# Altium schematic sheet Vapeix_mini_nrf.SchDoc: Vapeix Mini PCB - nRF Radio
size A3; DrawnBy: Rock Jon; Organization: Altium Limited; Address1: L3, 12a Rodborough Rd; Address2: Frenchs Forest; Address3: NSW; Address4: Australia 2086; DocumentNumber: 1; Revision: v1.0; SheetNumber: 1; SheetTotal: 1
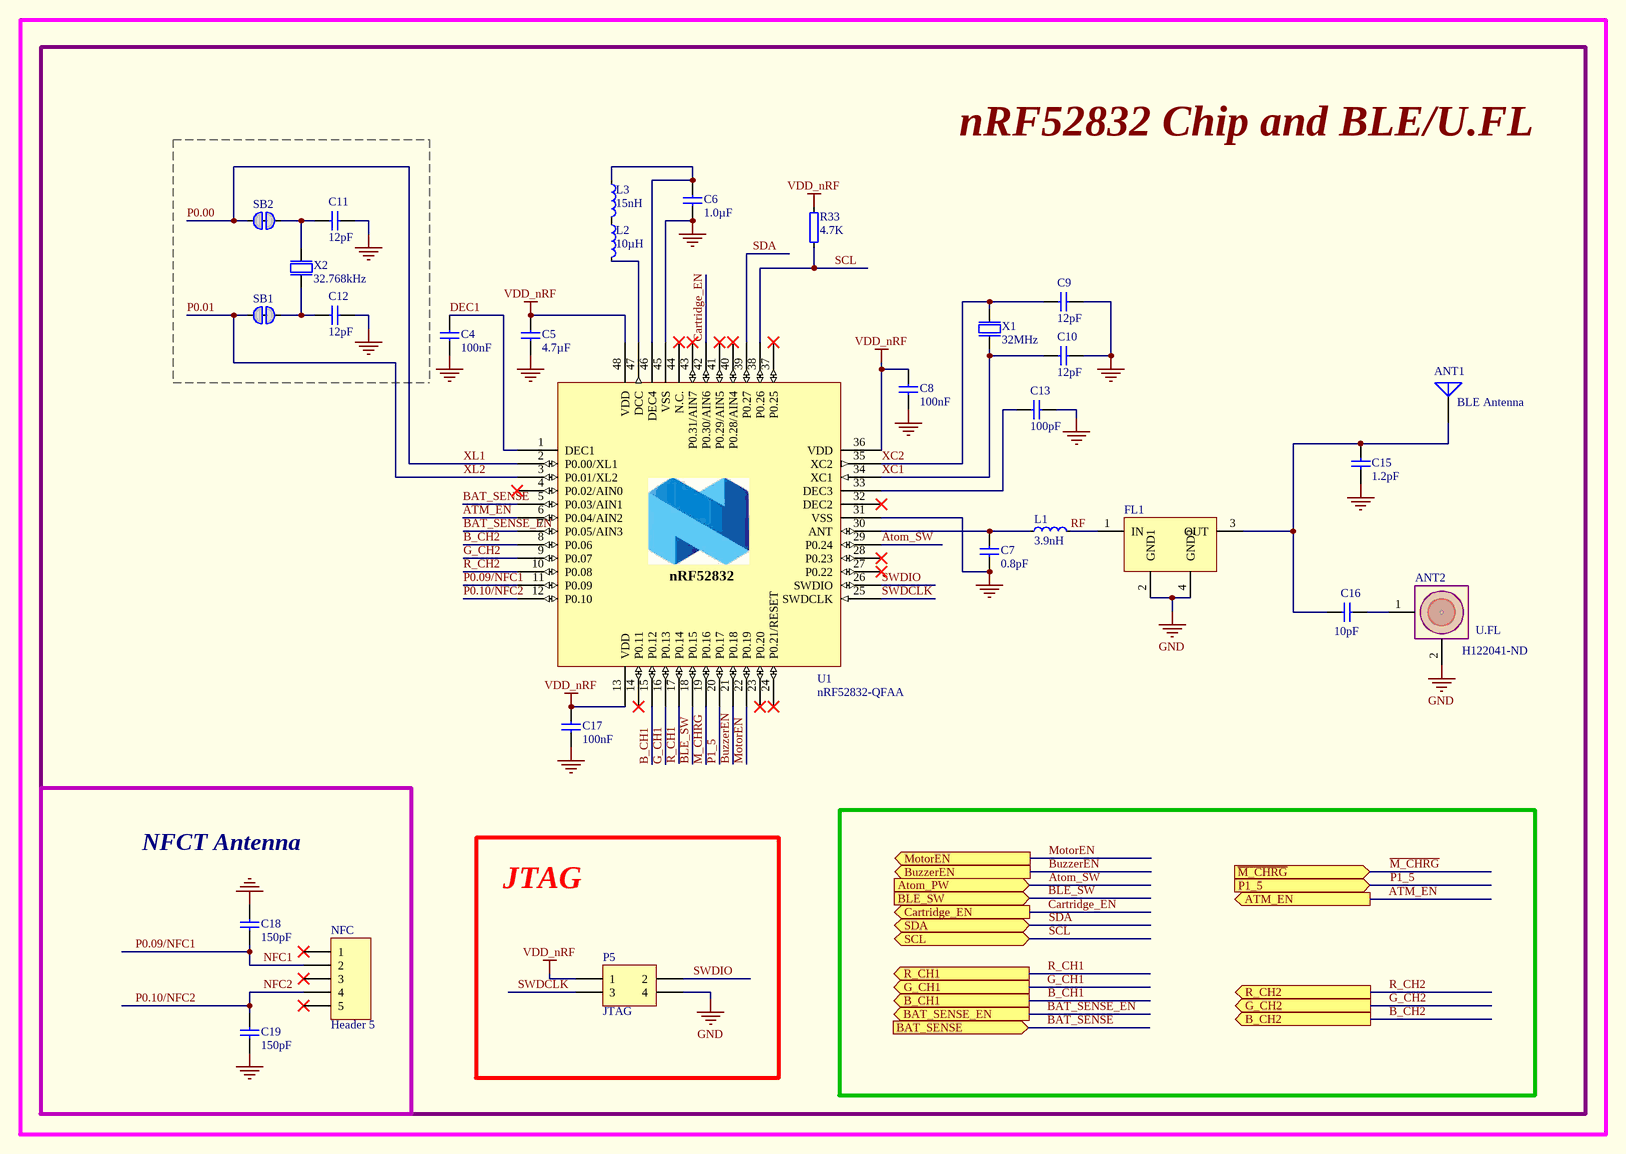
[diagram p0: Vapeix_mini_nrf.SchDoc]

## Parts
ANT1  BLE Antenna  [ANT_2450AT18A100]
ANT2  U.FL  Supplier Part Number 1: H122041-ND  [UFL-R-SMT]
C4  100nF  [C0201]
C5  4.7µF  [C0201]
C6  1.0µF  [C0201]
C7  0.8pF  [C0201]
C8  100nF  [C0201]
C9  12pF  [C0201]
C10  12pF  [C0201]
C11  12pF  [C0201]
C12  12pF  [C0201]
C13  100pF  [C0201]
C15  1.2pF  [C0201]
C16  10pF  [C0201]
C17  100nF  [C0201]
C18  150pF  [C0201]
C19  150pF  [C0201]
FL1  DEA202450BT-1294C1-H  [DEA202450BT-1294C1-H]  (value not drawn)
L1  3.9nH  [C0201]
L2  10µH  [INDC1608X06L]
L3  15nH  [C0201]
NFC  Header 5  [Molex 051281-0594]
P5  JTAG  [CON4]
R33  4.7K  [R0201]
SB1  Solderbridge  [Solderbridge_Shorted]  (value not drawn)  (net tie, no BOM)
SB2  Solderbridge  [Solderbridge_Shorted]  (value not drawn)  (net tie, no BOM)
U1  nRF52832-QFAA  [QFN40P600X600X90-48N]
X1  32MHz  [BT-XTAL_2016]
X2  32.768kHz  [XTAL_3215]

## Blocks framed on the sheet
NFCT Antenna: C18 C19 NFC

## Ports
ATM_EN (out), Atom_PW (in), B_CH1 (out), B_CH2 (out), BAT_SENSE (in), BAT_SENSE_EN (out), BLE_SW (in), BuzzerEN (out), Cartridge_EN (out), G_CH1 (out), G_CH2 (out), MotorEN (out), P1_5 (in), R_CH1 (out), R_CH2 (out), SCL (bidir), SDA (bidir), ~{M_CHRG} (in)

## Nets
GND: ANT2.2(GND) C4.2 C5.2 C6.1 C7.1 C8.2 C9.2 C10.2 C11.1 C12.1 C13.2 C15.2 C17.2 C18.2 C19.1 FL1.2(GND1) FL1.4(GND2) P5.4 U1.31(VSS) U1.45(VSS) U1.49(GND) X1.2(GND) X1.4(GND)
VDD_nRF: C5.1 C8.1 C17.1 P5.1 R33.2 U1.13(VDD) U1.36(VDD) U1.48(VDD)
ATM_EN: U1.6(P0.04/AIN2) ; port ATM_EN
Atom_SW: U1.29(P0.24) ; port Atom_PW
B_CH1: U1.15(P0.12) ; port B_CH1
B_CH2: U1.8(P0.06) ; port B_CH2
BAT_SENSE: U1.5(P0.03/AIN1) ; port BAT_SENSE
BAT_SENSE_EN: U1.7(P0.05/AIN3) ; port BAT_SENSE_EN
BLE_SW: U1.18(P0.15) ; port BLE_SW
BuzzerEN: U1.21(P0.18) ; port BuzzerEN
Cartridge_EN: U1.42(P0.30/AIN6) ; port Cartridge_EN
DEC1: C4.1 U1.1(DEC1)
G_CH1: U1.16(P0.13) ; port G_CH1
G_CH2: U1.9(P0.07) ; port G_CH2
~{M_CHRG}: U1.19(P0.16) ; port ~{M_CHRG}
MotorEN: U1.22(P0.19) ; port MotorEN
NFC1: C18.1 NFC.2 U1.11(P0.09)  [also labelled P0.09/NFC1]
NFC2: C19.2 NFC.4 U1.12(P0.10)  [also labelled P0.10/NFC2]
P0.00: SB2.2 U1.2(P0.00/XL1)  [also labelled XL1]
P0.01: SB1.2 U1.3(P0.01/XL2)  [also labelled XL2]
P1_5: U1.20(P0.17) ; port P1_5
R_CH1: U1.17(P0.14) ; port R_CH1
R_CH2: U1.10(P0.08) ; port R_CH2
RF: FL1.1(IN) L1.2
SCL: R33.1 U1.38(P0.26) ; port SCL
SDA: U1.39(P0.27) ; port SDA
SWDCLK: P5.3 U1.25(SWDCLK)
SWDIO: P5.2 U1.26(SWDIO)
XC1: C10.1 U1.34(XC1) X1.1(inp)
XC2: C9.1 U1.35(XC2) X1.3(out)
NetANT1_1: ANT1.1(A) C15.1 C16.1 FL1.3(OUT)
NetANT2_1: ANT2.1(SIG) C16.2
NetC6_2: C6.2 L3.1 U1.46(DEC4)
NetC7_2: C7.2 L1.1 U1.30(ANT)
NetC11_2: C11.2 SB2.1 X2.1(inp)
NetC12_2: C12.2 SB1.1 X2.2(out)
NetC13_1: C13.1 U1.33(DEC3)
NetL2_1: L2.1 L3.2
NetL2_2: L2.2 U1.47(DCC)

Not connected (* = marked no-connect by the designer): NFC 1* 3* 5*; U1 4(P0.02/AIN0)* 14(P0.11)* 23(P0.20)* 24(P0.21/RESET)* 27(P0.22)* 28(P0.23)* 32(DEC2)* 37(P0.25)* 40(P0.28/AIN4)* 41(P0.29/AIN5)* 43(P0.31/AIN7)* 44(N.C.)*

## Notes on the sheet
- Labels drawn without touching a wire or pin: JTAG, nRF52832 Chip and BLE/U.FL
- Title
- Size:
- Date:
- A4
- Number:
- Time:
- Revision:
- Sheet
- of
- Drawn by:
- File:
- (in symbol nRF52832-QFAA) nRF52832

## Library data of the parts
ANT1 = Antenna: Generic Antenna; Published: 24-Mar-1999; LatestRevisionDate: 17-Jul-2002; LatestRevisionNote: Re-released for DXP Platform.; PackageReference: PIN1; Publisher: Altium Limited
ANT2 = U.FL-R-SMT-1(01): CONN UMC JACK STR 50 OHM SMD; Manufacturer: Hirose Electric Co Ltd; Connector Style: U.FL, Ultra Miniature Coaxial; Connector Type: Jack, Male Pin; Contact Termination: Solder; Impedance: 50 Ohm; Frequency - Max: 6GHz; Body Material: Phosphor Bronze; Body Finish: Silver; Center Contact Plating: Gold; Dielectric Material: Liquid Crystal Polymer (LCP); Supplier 1: Digi-Key; Manufacturer Part Number: U.FL-R-SMT-1(01); RoHS: RoHS Compliant; Category: Connectors, Interconnects; Stock 1: 2248; Pricing 1: 1=1.28, 10=1.122, 25=1.056, 50=1.012, 100=0.968, 250=0.88, 500=0.792, 1000=0.704, 2500=0.638 (USD); Packaging: Bulk; Shield Termination: Solder; Mounting Type: Surface Mount; Cable Group: -; Fastening Type: Snap-On; Features: -; Housing Color: Silver; Ingress Protection: -; Center Contact Material: Phosphor Bronze; Voltage Rating: -; Operating Temperature: -40°C ~ 90°C; ComponentLink1URL: http://media.digikey.com/pdf/Data%20Sheets/Hirose%20PDFs/UFL%20Series.pdf; ComponentLink1Description: http://media.digikey.com/pdf/Data%20Sheets/Hirose%20PDFs/UFL%20Series.pdf
C4 C8 C17 = C0402-100n: Capacitor, X7R, ±10%; Note: 16V; Artikkelnr Noca: 20039200; Artikkelnr Simpro: N.A.; Part Number: C0402-100n; Manufacturer: *; Manufacturer Part Number: *; Datasheet: *; LatestRevisionDate: 2009-11-23; Pin Count: 2; Publisher: Nordic Semiconductor; Published: 2009-05-08; Value: 100nF; Supplier: *; Supplier part number: *; 2nd source Supplier: *; 2nd source part number: *; Footprint Doc: 0402
C5 = C0603-4µ7: Capacitor, X5R, ±10%; Note: 6.3V; Artikkelnr Noca: 20069060; Artikkelnr Simpro: N.A.; Part Number: C0603-4µ7; Manufacturer: *; Manufacturer Part Number: *; Datasheet: *; LatestRevisionDate: 2009-11-23; Pin Count: 2; Publisher: Nordic Semiconductor; Published: 2009-05-08; Value: 4.7µF; Supplier: *; Supplier part number: *; 2nd source Supplier: *; 2nd source part number: *; Footprint Doc: 0603
C6 = C0603-1µ0: Capacitor, X7R, ±10%; Note: 16V; Artikkelnr Noca: 20039335; Artikkelnr Simpro: N.A.; Part Number: C0603-1µ0; Manufacturer: *; Manufacturer Part Number: *; Datasheet: *; LatestRevisionDate: 2013-06-05; Pin Count: 2; Publisher: Nordic Semiconductor; Published: 2009-05-08; Value: 1.0µF; Supplier: *; Supplier part number: *; 2nd source Supplier: *; 2nd source part number: *; Footprint Doc: 0603
C7 = C0402-0.8p: Capacitor, NP0, ±5%; Note: 50V; Artikkelnr Noca: 20029147; Artikkelnr Simpro: N.A.; Part Number: C0402-0.8p; Manufacturer: *; Manufacturer Part Number: *; Datasheet: *; LatestRevisionDate: 2012-11-21; Pin Count: 2; Publisher: Nordic Semiconductor; Published: 2009-05-08; Value: 0.8pF; Supplier: *; Supplier part number: *; 2nd source Supplier: *; 2nd source part number: *; Footprint Doc: 0402
C9-C12 = C0402-12p: Capacitor, NP0, ±2%; Note: 50V; Artikkelnr Noca: 20029159; Artikkelnr Simpro: N.A.; Part Number: C0402-12p; Manufacturer: *; Manufacturer Part Number: *; Datasheet: *; LatestRevisionDate: 2011-05-11; Pin Count: 2; Publisher: Nordic Semiconductor; Published: 2009-05-08; Value: 12pF; Supplier: *; Supplier part number: *; 2nd source Supplier: *; 2nd source part number: *; Footprint Doc: 0402
C13 = C0402-100p: Capacitor, NP0, ±5%; Note: 50V; Artikkelnr Noca: 20029135; Artikkelnr Simpro: N.A.; Part Number: C0402-100p; Manufacturer: *; Manufacturer Part Number: *; Datasheet: *; LatestRevisionDate: 2009-05-08; Pin Count: 2; Publisher: Nordic Semiconductor; Published: 2009-05-08; Value: 100pF; Supplier: *; Supplier part number: *; 2nd source Supplier: *; 2nd source part number: *; Footprint Doc: 0402
C15 = C0402-1.2p: Capacitor, NP0, ±0.1pF; Note: 50V; Artikkelnr Noca: 20029157; Artikkelnr Simpro: N.A.; Part Number: C0402-1.2p; Manufacturer: *; Manufacturer Part Number: *; Datasheet: *; LatestRevisionDate: 2011-05-11; Pin Count: 2; Publisher: Nordic Semiconductor; Published: 2009-05-08; Value: 1.2pF; Supplier: *; Supplier part number: *; 2nd source Supplier: *; 2nd source part number: *; Footprint Doc: 0402
C16 = C0402-N.C.: Not mounted; Note: Chip Cap; Artikkelnr Noca: N.A.; Part Number: C0402-N.C.; Manufacturer: *; Manufacturer Part Number: *; Datasheet: *; LatestRevisionDate: 2009-05-08; Pin Count: 2; Publisher: Nordic Semiconductor; Published: 2009-05-08; Value: 10pF; Supplier: *; Supplier part number: *; 2nd source Supplier: *; 2nd source part number: *; Footprint Doc: 0402; Artikkelnr Simpro: N.A.
C18 C19 = C0402-300p: Capacitor, NP0, ±5%; Note: 50V; Artikkelnr Noca: N.A.; Part Number: C0402-300p; Manufacturer: *; Manufacturer Part Number: *; Datasheet: *; Footprint Doc: 0402; LatestRevisionDate: 2015-05-29; Pin Count: 2; Publisher: Nordic Semiconductor; Published: 2015-05-29; Value: 150pF; Supplier: Digi-Key; Supplier part number: 490-3234-1-ND; 2nd source Supplier: *; 2nd source part number: *; Artikkelnr Simpro: N.A.
FL1 = DEA202450BT-1294C1-H (2): FILTER BANDPASS WLAN&BLUETOOTH; Manufacturer: TDK Corporation; Supplier 1: Digi-Key; Manufacturer Part Number: DEA202450BT-1294C1-H; RoHS: RoHS Compliant; Category: Filters; Stock 1: 14479; Pricing 1: 1=0.51, 10=0.477, 100=0.4252, 250=0.40324, 500=0.33724, 1000=0.26173 (USD); ComponentLink1URL: https://product.tdk.com/info/en/documents/data_sheet/rf_bpf_dea202450bt-1294c1-h_en.pdf; ComponentLink1Description: https://product.tdk.com/info/en/documents/data_sheet/rf_bpf_dea202450bt-1294c1-h_en.pdf; Supplier Part Number 1: 445-172335-1-ND
L1 = L0402-3n9: Inductor, 170mA, ±0.1nH; Manufacturer: Murata; Manufacturer Part Number: LQP15MN3N9B02D; Note: High frequency chip inductor ±5%; Artikkelnr Noca: 33029151; Artikkelnr Simpro: N.A.; Part Number: L0402-3n9; Datasheet: http://search.murata.co.jp/Ceramy/image/img/PDF/ENG/L0075S0084LQP15M.pdf; LatestRevisionDate: 2012-09-19; Pin Count: 2; Publisher: Nordic Semiconductor; Published: 2009-05-08; Value: 3.9nH; Supplier: Digi-Key; Supplier part number: 490-1131-1-ND; 2nd source Supplier: *; 2nd source part number: *; Footprint Doc: 0402
L2 = L0603-10µ: Inductor, 80mA, ±10%; Manufacturer: Taiyo Yuden; Manufacturer Part Number: LBMF1608T100K; 2nd source part number: 178-6105; Note: LBMF1608T100K 10µH 80mA 0603; Artikkelnr Noca: 33029314; Artikkelnr Simpro: N.A.; Part Number: L0603-10µ; Datasheet: http://www.yuden.co.jp/ut/product/pdf/elb2_e.pdf; LatestRevisionDate: 2012-09-19; Pin Count: 2; Publisher: Nordic Semiconductor; Published: 2010-02-24; Value: 10µH; Supplier: Digi-Key; Supplier part number: 587-1714-1-ND; 2nd source Supplier: Farnell; Footprint Doc: 0603
L3 = L0402-15n: Inductor, 320mA, ±5%; Manufacturer: Taiyo Yuden; Manufacturer Part Number: HK100515NJ-T; 2nd source part number: 658-1328; Note: High frequency chip inductor ±10%; Artikkelnr Noca: 33029323; Artikkelnr Simpro: N.A.; Part Number: L0402-15n; LatestRevisionDate: 2012-09-19; Pin Count: 2; Publisher: Nordic Semiconductor; Published: 2010-07-12; Value: 15nH; Supplier: Digi-Key; Datasheet: http://www.yuden.co.jp/productdata/catalog/en/mlci04_e.pdf; Supplier part number: 587-1521-1-ND; 2nd source Supplier: Farnell; Footprint Doc: 0402
NFC = Header 5: Header, 5-Pin; LatestRevisionDate: 17-Jul-2002; LatestRevisionNote: Re-released for DXP Platform.; Publisher: Altium Limited
P5 = Header 2X2: Header, 2-Pin, Dual row; LatestRevisionDate: 17-Jul-2002; LatestRevisionNote: Re-released for DXP Platform.; Publisher: Altium Limited
R33 = R0402-10k: Resistor, ±1%, 0.063W; Note: Chip Res 1%; Artikkelnr Noca: 27049097; Artikkelnr Simpro: N.A.; Part Number: R0402-10k; Manufacturer: *; Manufacturer Part Number: *; Datasheet: *; Footprint Doc: 0402; LatestRevisionDate: 2009-11-23; Pin Count: 2; Publisher: Nordic Semiconductor; Published: 2009-05-08; Value: 4.7K; Supplier: Farnell; Supplier part number: 173-8864; 2nd source Supplier: *; 2nd source part number: *
SB1 SB2 = Solderbridge Shorted: Shorted Solderbridge; Artikkelnr Noca: N.A.; Part Number: Solderbridge Shorted; Manufacturer: *; Manufacturer Part Number: *; Datasheet: *; LatestRevisionDate: 2012-08-07; Pin Count: 2; Publisher: Nordic Semiconductor; Published: 2012-08-07; Value: Solderbridge; Note: *; Supplier: *; Supplier part number: *; 2nd source Supplier: *; 2nd source part number: *; Footprint Doc: Solderbridge_Shorted; Artikkelnr Simpro: N.A.
U1 = nRF52832-QFAA: Multi-protocol Bluetooth Low Energy and 2.4GHz proprietary system-on-chip; Manufacturer: Nordic Semiconductor; Artikkelnr Noca: N.A.; Part Number: nRF52832-QFAA; Manufacturer Part Number: nRF52832-QFAA; Datasheet: *; LatestRevisionDate: 2014-11-26; Pin Count: 48; Publisher: Nordic Semiconductor; Published: 2014-11-26; Value: nRF52832-QFAA; Note: *; Supplier: Nordic Semiconductor; Supplier part number: *; 2nd source Supplier: *; 2nd source part number: *; Footprint Doc: QFN-48; Artikkelnr Simpro: N.A.
X1 = XTAL_SMD2016_32MHz_8pF_Epson: XTAL SMD 2016, 32MHz, Cl=8pF, Tol: ±10ppm, Stab: ±10ppm; Manufacturer: Epson Toyocom; Manufacturer Part Number: Q22FA12800025; Note: XTAL SMD 32.000MHz; Artikkelnr Noca: N.A.; Part Number: XTAL_SMD2016_32MHz_8pF_Epson; Datasheet: http://www.epsondevice.com/docs/qd/en/DownloadServlet?id=ID000449; LatestRevisionDate: 2014-11-27; Pin Count: 4; Publisher: Nordic Semiconductor; Published: 2012-03-09; Value: 32MHz; Supplier: Farnell; Supplier part number: 171-2806; 2nd source Supplier: *; 2nd source part number: *; Footprint Doc: XTAL_2016; Artikkelnr Simpro: N.A.
X2 = XTAL_FC-135 32.768k: EPSON TOYOCOM - FC-135 32.768KHZ ±20PPM,9.0PF - CRYSTAL, SM, WATCH; 2nd source part number: 127-8037; Note: XTAL SMD 32.768kHz, 3215; Artikkelnr Noca: 22019091; Artikkelnr Simpro: N.A.; Part Number: XTAL_FC-135 32.768k; Manufacturer: Epson Toyocom; Manufacturer Part Number: FC-135 32.768KHZ ±20PPM,9.0PF; Datasheet: http://www.farnell.com/datasheets/57480.pdf; LatestRevisionDate: 2014-03-27; Pin Count: 2; Publisher: Nordic Semiconductor; Published: 2010-10-18; Value: 32.768kHz; Supplier: Digi-Key; Supplier part number: FC-135 32.7680KA-AC-ND; 2nd source Supplier: Farnell; Footprint Doc: XTAL_3215